# EAGLE design micro_pogo (EAGLE 8.2.2)
DATABASE: ./../../../../../Components/TinyCircuits_Part_Database.txt
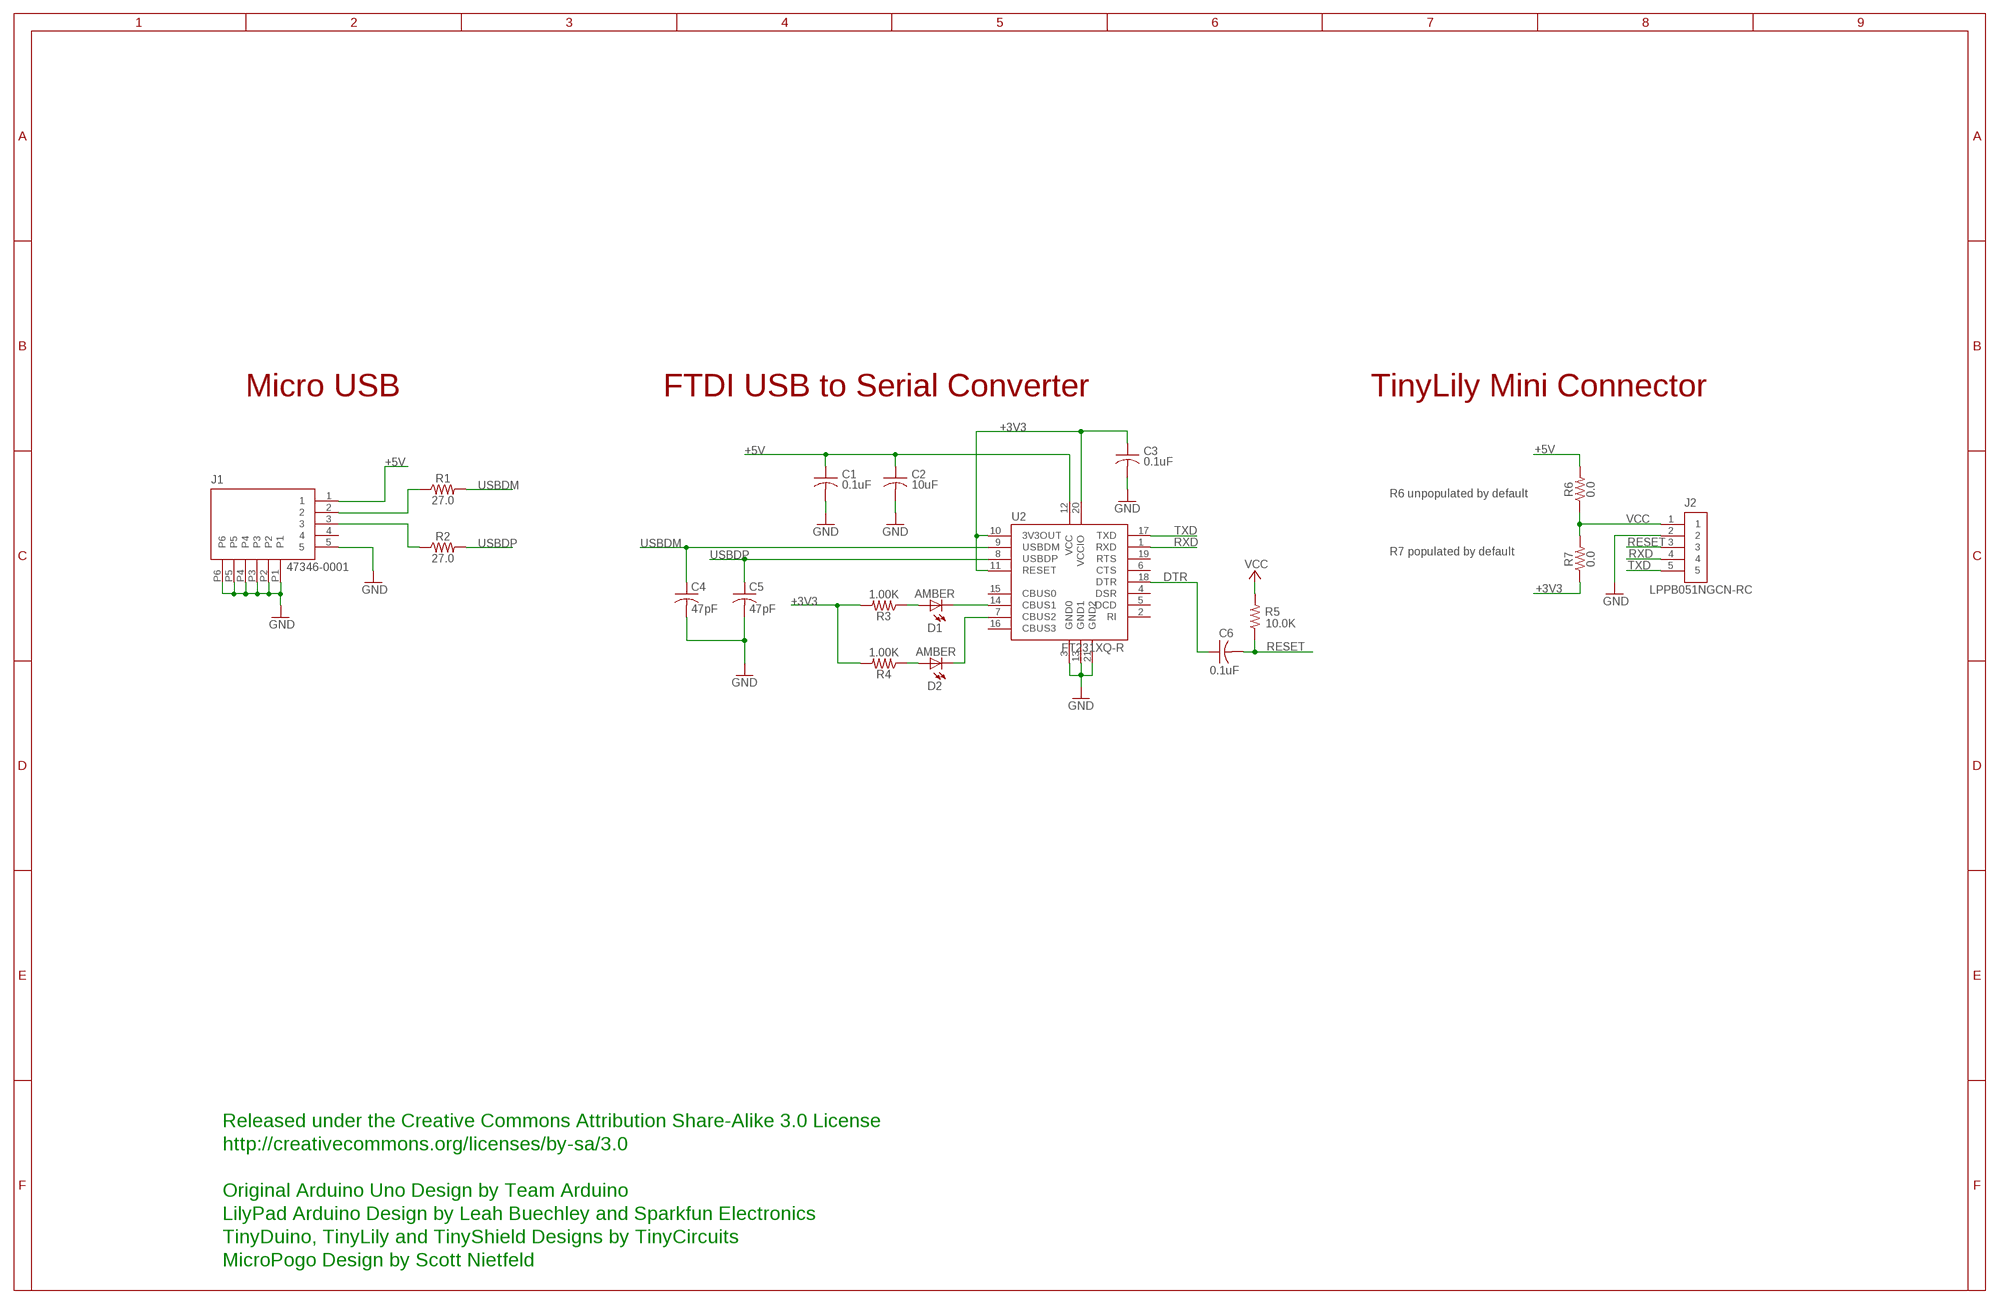
[diagram p0: schematic, sheet 1]

## Parts
C1  0.1uF  AS-ITM-00008  [C0402]
C2  10uF  AS-ITM-00002  [C0603]
C3  0.1uF  AS-ITM-00008  [C0402]
C4  47pF  AS-ITM-00241  [0402]
C5  47pF  AS-ITM-00241  [0402]
C6  0.1uF  AS-ITM-00008  [C0402]
D1  AMBER  AS-ITM-00026  [LNJ_LED]
D2  AMBER  AS-ITM-00026  [LNJ_LED]
J1  47346-0001  AS-ITM-00021  [MICRO_USB]
J2  LPPB051NGCN-RC  AS-ITM-00037  [1X5_.05_RA_TH_RECPT]
R1  27.0  AS-ITM-00240  [0402]
R2  27.0  AS-ITM-00240  [0402]
R3  1.00K  AS-ITM-00003  [0402]
R4  1.00K  AS-ITM-00003  [0402]
R5  10.0K  AS-ITM-00032  [0402]
R6  0.0  AS-ITM-00076  [0402]
R7  0.0  AS-ITM-00076  [0402]
U2  FT231XQ-R  AS-ITM-00223  [QFN20]

## Nets
+3V3: C3.1 R3.2 R4.2 R7.1 U2.10(3V3OUT) U2.11(RESET) U2.20(VCCIO)
+5V: C1.1 C2.1 J1.1 R6.2 U2.12(VCC)
DTR: C6.1 U2.18(DTR)
GND: C1.2 C2.2 C3.2 C4.2 C5.2 J1.5 J1.P1 J1.P2 J1.P3 J1.P4 J1.P5 J1.P6 J2.2 U2.3(GND0) U2.13(GND1) U2.21(GND2)
N$1: D2.C U2.7(CBUS2)
N$2: D1.A R3.1
N$7: D2.A R4.1
N$14: J1.2 R1.1
N$15: J1.3 R2.1
N$16: D1.C U2.14(CBUS1)
RESET: C6.2 J2.3 R5.1
RXD: J2.4 U2.1(RXD)
TXD: J2.5 U2.17(TXD)
USBDM: C4.1 R1.2 U2.9(USBDM)
USBDP: C5.1 R2.2 U2.8(USBDP)
VCC: J2.1 R5.2 R6.1 R7.2
Unconnected: J1.4 U2.2(RI) U2.4(DSR) U2.5(DCD) U2.6(CTS) U2.15(CBUS0) U2.16(CBUS3) U2.19(RTS)

## Notes on the sheet
- Micro USB | FTDI USB to Serial Converter | TinyLily Mini Connector
- R6 unpopulated by default
- R7 populated by default
- Released under the Creative Commons Attribution Share-Alike 3.0 License
- http://creativecommons.org/licenses/by-sa/3.0
- Original Arduino Uno Design by Team Arduino
- LilyPad Arduino Design by Leah Buechley and Sparkfun Electronics
- TinyDuino, TinyLily and TinyShield Designs by TinyCircuits
- MicroPogo Design by Scott Nietfeld

## Library data of the parts
C1 C3 C6 = tinycircuits:AS-ITM-00008: CAP CER 0.1UF 16V 10% X5R 0402; PARTNO: AS-ITM-00008
C2 = tinycircuits:AS-ITM-00002: CAP CER 10UF 10V 20% X5R 0603; PARTNO: AS-ITM-00002
C4 C5 = tinycircuits:AS-ITM-00241: CAP CER 47PF 50V 5% NP0 0402; PARTNO: AS-ITM-00241
D1 D2 = tinycircuits:AS-ITM-00026: LED AMBER SIDE VIEW SMD; PARTNO: AS-ITM-00026
J1 = tinycircuits:AS-ITM-00021: CONN RCPT 5POS MICRO USB R/A; PARTNO: AS-ITM-00021
J2 = tinycircuits:AS-ITM-00037: CONN HEADER .050" 5POS TH RA RECPT; PARTNO: AS-ITM-00037
R1 R2 = tinycircuits:AS-ITM-00240: RES 27 OHM 1/16W 5% 0402 SMD; PARNTO: AS-ITM-00240
R3 R4 = tinycircuits:AS-ITM-00003: RES 1.00K OHM 1/16W 1% 0402; PARTNO: AS-ITM-00003
R5 = tinycircuits:AS-ITM-00032: RES 10.0K OHM 1/16W 1% 0402 SMD; PARTNO: AS-ITM-00032
R6 R7 = tinycircuits:AS-ITM-00076: RES 0.0 OHM 1/16W 1% 0402 SMD; PARTNO: AS-ITM-00076
U2 = tinycircuits:AS-ITM-00223: IC USB SERIAL FULL UART 20QFN; PARTNO: AS-ITM-00223

## Net classes
2 gnd: width 0.305 mm, drill 0.559 mm, clearance 0.254 mm

## Board
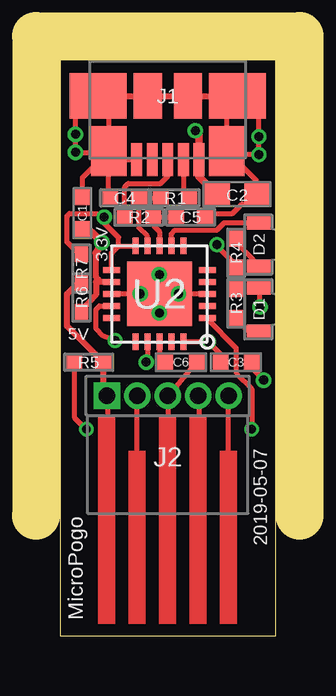
[diagram p1: board, top side]
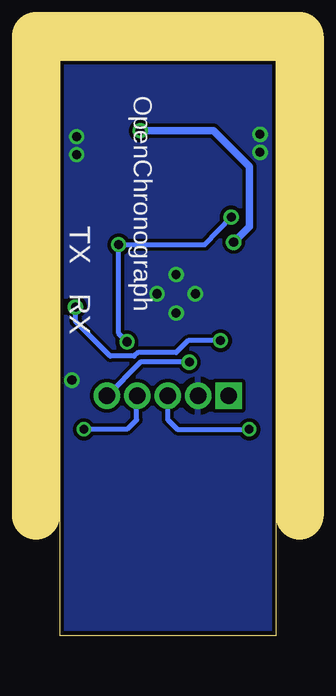
[diagram p2: board, bottom side, seen from below]

Size 9 x 24 mm. Coordinates in mm from the lower left corner, seen from the top.
Outline: 0,0 9,0 9,24 0,24 0,0
Copper layers (1*16): Top 0.035mm / dielectric 1.5mm / Bottom 0.035mm
Design rules "default *": minimum track width 8mil, minimum drill 15mil, track to track 6mil, track to pad 6mil, pad to pad 6mil, via to via 6mil, smd to smd 6mil, copper to edge 6mil, drill to drill 8mil, minimum pad ring 8mil, minimum via ring 5mil, stop-mask expansion 4mil, vias tented up to drill 25mil, thermal gap 10mil
bRestrict: 1 lines
Milling: 3 lines

### Footprints (pad centres in the part's own frame; a part is rotated, then mirrored left to right if it is on the bottom)
C0402 = smd 0.65 x 0.6: 1 -0.65,0; 2 0.65,0
C0603 = smd 1.1 x 1: 1 -0.85,0; 2 0.85,0
0402 = smd 0.65 x 0.55: 1 -0.6,0; 2 0.6,0
LNJ_LED = smd 1 x 0.55: A 0,0.9; C 0,-0.9
MICRO_USB = smd 1.38 x 0.45: 1 2.66,1.3; 2 2.66,0.65; 3 2.66,0; 4 2.66,-0.65; 5 2.66,-1.3 | smd 2.1 x 1.475: P1 2.3,-2.462; P2 2.3,2.462 | smd 1.9 x 2.375: P3 0,2.913; P4 0,-2.913 | smd 1.9 x 1.175: P5 0,0.838; P6 0,-0.838
1X5_.05_RA_TH_RECPT = drill 0.7 pad 1.016 square: 1 0,2.54 | drill 0.7 pad 1.016: 2 0,1.27; 3 0,0; 4 0,-1.27; 5 0,-2.54
QFN20 = smd 0.7 x 0.25: 1 -2,1; 2 -2,0.5; 3 -2,0; 4 -2,-0.5; 5 -2,-1; 11 2,-1; 12 2,-0.5; 13 2,0; 14 2,0.5; 15 2,1 | smd 0.25 x 0.7: 6 -1,-2; 7 -0.5,-2; 8 0,-2; 9 0.5,-2; 10 1,-2; 16 1,2; 17 0.5,2; 18 0,2; 19 -0.5,2; 20 -1,2 | smd 2.7 x 2.7: 21 0,0

### Placement (x,y rotation side)
C1  0.94,17.61 90 top
C2  7.39,18.4 0 top
C3  7.35,11.4 0 top
C4  2.7,18.25 180 top
C5  5.45,17.45 0 top
C6  5.05,11.4 0 top
D1  8.3,13.6 180 top
D2  8.3,16.3 180 top
J1  4.5,22.5 270 top
J2  4.5,10 90 top
R1  4.8,18.25 180 top
R2  3.3,17.45 0 top
R3  7.35,13.85 90 top
R4  7.35,15.95 270 top
R5  1.2,11.4 0 top
R6  0.9,14.1 270 top
R7  0.9,15.3 270 top
U2  4.15,14.25 180 top

### Tracks (layer width: path | path; a pad name or v marks a point on that pad's centre or on a via)
+3V3  (via drill 0.38)
  Top 0.203: U2.11 2.15,15.95 2.45,16.25 | 2.45,16.25 U2.10 | R4.2 R3.2 7.3,15.1 7.3,15.5 6.55,16.25 v6.55,16.3 | 0.84,15.86 0.3,16.4 0.3,17.5 0.4,17.6 1.7,17.6 v1.85,17.45 1.85,17.2 2.45,16.6 2.45,16.25 | C3.1 6.7,11.75 v6.2,12.25 U2.20
  Top 0.254: 0.84,15.86 0.88,15.9 R7.1
  Bottom 0.203: v1.85,17.45 2.95,16.3 v6.55,16.3 6.55,12.6 v6.2,12.25
+5V  (via drill 0.38)
  Top 0.203: C1.1 1.16,16.96 | 1.5,14.75 1.6,14.85
  Top 0.254: U2.12 1.5,14.75 1.5,14.2 0.9,13.54 R6.2 | 1.6,14.85 1.5,14.95 1.5,15.95
  Top 0.305: C2.1 5.8,19.14 J1.1 5.8,20.9 v5.65,21.05 | 1.16,16.96 v1.75,16.4 1.5,15.95
  Bottom 0.305: v5.65,21.05 2.6,21.05 1.1,19.55 1.1,17.05 v1.75,16.4
DTR
  Top 0.203: U2.18 4.15,11.75 C6.1
GND  (via drill 0.38)
  Top 0.203: J1.P1 2.04,18.61 2.1,18.55 C4.2 | U2.3 U2.21 | U2.21 U2.13 | J1.P4 2.04,22.05 J1.P1 | J1.P1 2.4,19.84 J1.5 | J1.P3 6.96,22.5 J1.P2 8.24,18.92 C2.2 7.84,18 7.6,18 7.2,17.6 6.3,17.6 6.15,17.45 C5.2 | C1.2 0.94,19.1 J1.P1 | 8,11.6 C3.2 8,11.15 v8.5,10.65 | v4.15,15.05 U2.21 | 0.7,20.14 1.5,20.14 | 0.66,20.1 v0.66,20.9 | 0.66,20.95 0.66,21.75 | 8.31,20.9 8.31,21.7 | v8.3,20.06 7.5,20.06 | 8.29,20.85 v8.29,20.05
  Top 0.254: J1.P4 J1.P6 J1.P5 J1.P3 | 8.29,20.85 8.3,20.84 v8.3,20.8 8.3,20.89 8.31,20.9 | 7.5,20.06 7.36,20.2 J1.P2 | 0.7,20.14 0.69,20.15 v0.65,20.15 | v0.66,20.9 v0.65,20.9 0.65,20.94 0.66,20.95 | v8.3,20.06 v8.3,20.05
  Bottom 0.203: v8.5,10.65 8.5,10.7 8.55,10.75
  other vias: 4.95,14.25 4.15,13.45 3.35,14.25
  pour Bottom: 0,24 9,24 9,0 0,0
N$1
  Top 0.203: U2.7 4.65,16.75 4.8,16.9 6.55,16.9 6.85,17.2 D2.C
N$2
  Top 0.203: D1.A 7.85,12.7 R3.1
N$3
  Top 0.203: 2,7.6 2,10
N$4
  Top 0.203: 3.2,10 3.2,7.1
N$5
  Top 0.203: 4.5,9.9 4.5,8.7
N$6
  Top 0.203: 5.8,10 5.8,8.6
N$7
  Top 0.203: R4.1 7.3,16.45 D2.A
N$8
  Top 0.203: 7,10 7,7.3
N$14
  Top 0.203: J1.2 5.15,18.5 R1.1
N$15
  Top 0.203: R2.1 2.7,18.7 2.85,18.85 4.2,18.85 4.5,19.15 J1.3
N$16  (via drill 0.38)
  Top 0.203: D1.C v8.35,13.7 | v2.3,12.3 1.8,12.5 1.5,12.8 1.5,13.6 1.65,13.75 U2.14
  Bottom 0.203: v2.3,12.3 3.65,12.3 4.15,11.8 5.75,11.8 5.9,11.65 6.9,11.65 8.35,13.1 v8.35,13.7
RESET  (via drill 0.35)
  Top 0.203: C6.2 J2.3 | R5.1 0.6,9.1 v1.1,8.6
  Bottom 0.203: J2.3 4.5,9 4.1,8.6 v1.1,8.6
RXD  (via drill 0.35)
  Top 0.203: U2.1 6.15,13.2 7.35,12 7.35,10.95 8,10.3 v8,8.6
  Bottom 0.203: J2.4 5.8,9.97 5.8,9 6.2,8.6 v8,8.6
TXD  (via drill 0.38)
  Top 0.203: U2.17 3.65,11.45 v3.6,11.4
  Bottom 0.203: v3.6,11.4 5.64,11.4 J2.5
USBDM
  Top 0.203: U2.9 3.65,16.65 3.3,17 C4.1 R1.2
USBDP
  Top 0.203: R2.2 3.9,17.5 | R2.2 3.9,17.1 4.15,16.85 U2.8 | R2.2 C5.1
VCC
  Top 0.254: J2.1 1.8,10.16 R5.2 0.3,12.9 0.3,14.24 0.76,14.7 R6.1
(copper drawn outside any net)
  shapes: Top area x5

### Text on the board
tPlace: 3.3V | 5V | 2019-05-07 | MicroPogo
bPlace: OpenChronograph | TX | RX
Document: FABRICATION DRAWING | NOTES: | 1. PRINTED CIRCUIT BOARD MADE FROM NEMA GRADE FR-4 EPOXY LAMINATE | WITH 1 OUNCE COPPER PLATING AND .024 THICKNESS. | 2. ALL DIMENSIONS ARE GIVEN IN INCHES. | 3. CIRCUIT PATHS ARE FOR REFERENCE ONLY. | 4. HOLE SIZES SHOWN ARE FINISHED DIAMETERS AFTER PLATING. | 5. BOARD PLATED USING REFLOW OR SIMILAR METHOD. | 6. BOARD TO HAVE BLUE SOLDER MASK ON PLATED SURFACES USING WET FILM | 7. SILKSCREEN BOARD USING WHITE INK. | SR100 OR SR1010 EPOXY. EQUIVALENT WET OR DRY FILM MAY BE USED. | 8. THE FOLLOWING INFORMATION APPLIES TO THIS BOARD: | * 2 COPPER LAYERS | * .024 BOARD THICKNESS | * REQUIRES TOP SIDE SILKSCREEN | Released under the Creative Commons Attribution Share-Alike 3.0 License | http://creativecommons.org/licenses/by-sa/3.0 | Original Arduino Uno Design by Team Arduino | LilyPad Arduino Design by Leah Buechley and Sparkfun Electronics | MicroPogo Design by Scott Nietfeld | TinyDuino, TinyLily and TinyShield Designs by TinyCircuits | MicroPogo Serial Programmer